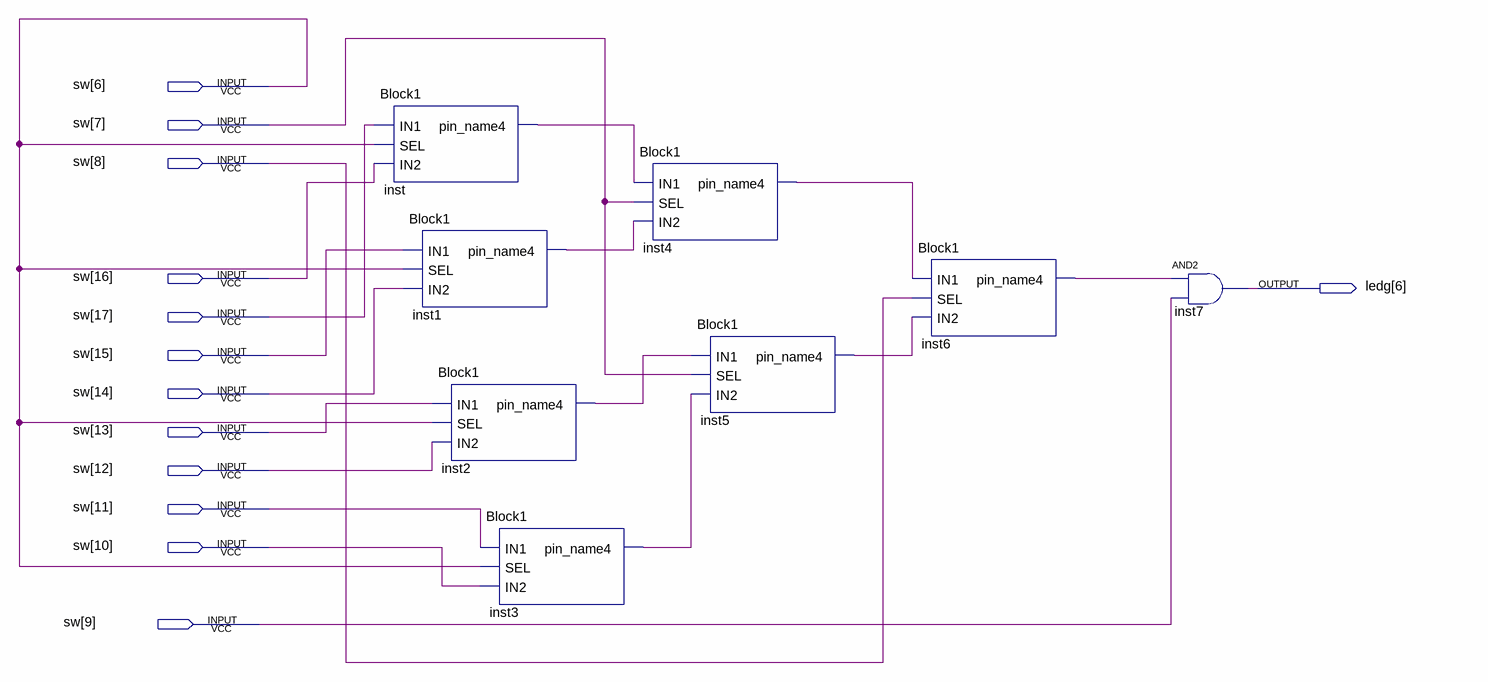
[diagram p0: schematic sheet]
// Quartus schematic Lab4.bdf as structural Verilog: 8 symbols, 13 pins
module Lab4 (
  input  [17:6] sw,
  output [6:6] ledg
);

  wire inst1_pin_name4, inst2_pin_name4, inst3_pin_name4, inst4_pin_name4, inst5_pin_name4, inst6_pin_name4,
       inst_pin_name4;

  Block1 inst (.IN1(sw[17]), .SEL(sw[6]), .IN2(sw[16]), .pin_name4(inst_pin_name4));
  Block1 inst1 (.IN1(sw[15]), .SEL(sw[6]), .IN2(sw[14]), .pin_name4(inst1_pin_name4));
  Block1 inst2 (.IN1(sw[13]), .SEL(sw[6]), .IN2(sw[12]), .pin_name4(inst2_pin_name4));
  Block1 inst3 (.IN1(sw[11]), .SEL(sw[6]), .IN2(sw[10]), .pin_name4(inst3_pin_name4));
  Block1 inst4 (.IN1(inst_pin_name4), .SEL(sw[7]), .IN2(inst1_pin_name4), .pin_name4(inst4_pin_name4));
  Block1 inst5 (.IN1(inst2_pin_name4), .SEL(sw[7]), .IN2(inst3_pin_name4), .pin_name4(inst5_pin_name4));
  Block1 inst6 (.IN1(inst4_pin_name4), .SEL(sw[8]), .IN2(inst5_pin_name4), .pin_name4(inst6_pin_name4));
  and inst7 (ledg[6], inst6_pin_name4, sw[9]);
endmodule
